# Altium schematic sheet MCU.SchDoc
size A3; SheetNumber: 2; SheetTotal: 4
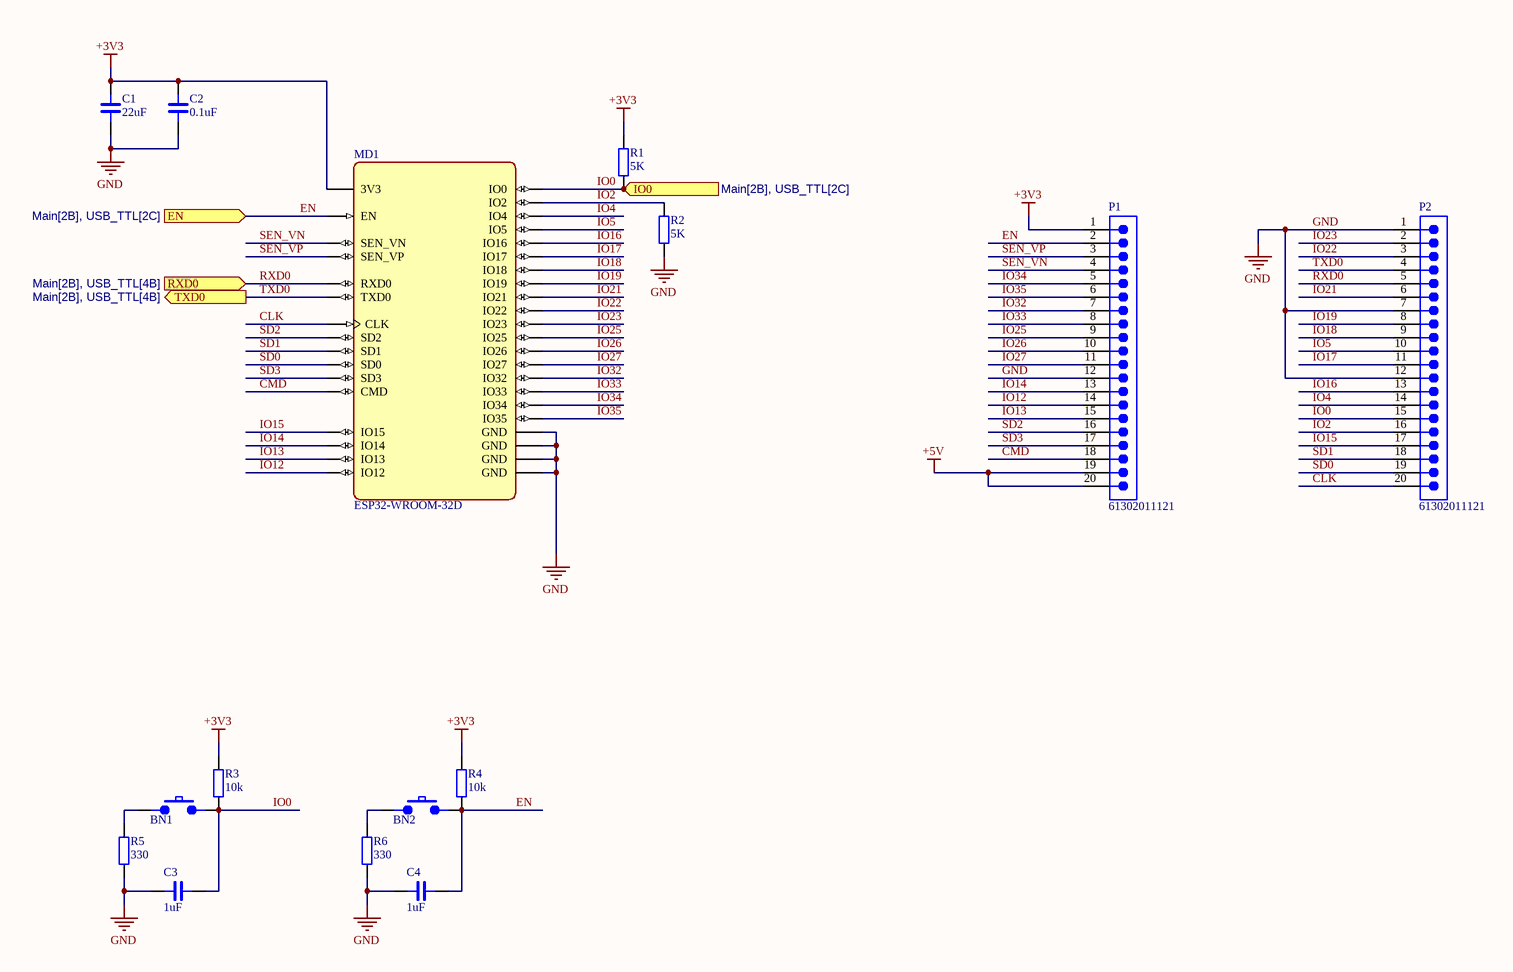
[diagram p0: MCU.SchDoc]

## Parts
BN1  SKRPABE010  [BTN_SKRPABE010]  (value not drawn)
BN2  SKRPABE010  [BTN_SKRPABE010]  (value not drawn)
C1  22uF  [CAP_0603]
C2  0.1uF  [CAP_0603]
C3  1uF  [CAP_0603]
C4  1uF  [CAP_0603]
MD1  ESP32-WROOM-32D  [MD_ESP32_WROOM_D]
P1  61302011121  [61302011121]
P2  61302011121  [61302011121]
R1  5K  [RES_0603]
R2  5K  [RES_0603]
R3  10k  [RES_0603]
R4  10k  [RES_0603]
R5  330  [RES_0603]
R6  330  [RES_0603]

## Ports
EN (in, see Main[2B], USB_TTL[2C]), IO0 (in, see Main[2B], USB_TTL[2C]), RXD0 (in, see Main[2B], USB_TTL[4B]), TXD0 (out, see Main[2B], USB_TTL[4B])

## Nets
+3V3: C1.2 C2.2 MD1.2(3V3) P1.1 R1.2 R3.2 R4.2
+5V: P1.19 P1.20
GND: C1.1 C2.1 C3.1 C4.1 MD1.1(GND) MD1.15(GND) MD1.38(GND) MD1.39(GND) P1.12 P2.1 P2.7 P2.12 R2.1 R5.1 R6.1
CLK: MD1.20(CLK) P2.20
CMD: MD1.19(CMD) P1.18
EN: BN2.34 C4.2 MD1.3(EN) P1.2 R4.1 ; port EN
IO0: BN1.34 C3.2 MD1.25(IO0) P2.15 R1.1 R3.1 ; port IO0
IO2: MD1.24(IO2) P2.16 R2.2
IO4: MD1.26(IO4) P2.14
IO5: MD1.29(IO5) P2.10
IO12: MD1.14(IO12) P1.14
IO13: MD1.16(IO13) P1.15
IO14: MD1.13(IO14) P1.13
IO15: MD1.23(IO15) P2.17
IO16: MD1.27(IO16) P2.13
IO17: MD1.28(IO17) P2.11
IO18: MD1.30(IO18) P2.9
IO19: MD1.31(IO19) P2.8
IO21: MD1.33(IO21) P2.6
IO22: MD1.36(IO22) P2.3
IO23: MD1.37(IO23) P2.2
IO25: MD1.10(IO25) P1.9
IO26: MD1.11(IO26) P1.10
IO27: MD1.12(IO27) P1.11
IO32: MD1.8(IO32) P1.7
IO33: MD1.9(IO33) P1.8
IO34: MD1.6(IO34) P1.5
IO35: MD1.7(IO35) P1.6
RXD0: MD1.34(RXD0) P2.5 ; port RXD0
SD0: MD1.21(SD0) P2.19
SD1: MD1.22(SD1) P2.18
SD2: MD1.17(SD2) P1.16
SD3: MD1.18(SD3) P1.17
SEN_VN: MD1.5(SEN_VN) P1.4
SEN_VP: MD1.4(SEN_VP) P1.3
TXD0: MD1.35(TXD0) P2.4 ; port TXD0
NetBN1_12: BN1.12 R5.2
NetBN2_12: BN2.12 R6.2

## Library data of the parts
BN1 BN2 = BTN_SKRPABE010: 3.2mm 2.5mm button 50mA Brick SPST 16V SMD Tactile Switches; Mfr.part: SKRPABE010; JLCPCB Part: ?; LCSC Part: ?
C1-C4 = CAP_0603: 0603 Multilayer Ceramic Capacitors MLCC - SMD/SMT ROHS; LCSC Part: ?; JLCPCB Part: ?; Mfr. Part: ?; Voltage: ?
  C1: Value: 22uF
  C2: Value: 0.1uF
  C3 C4: Value: 1uF
MD1 = MD_ESP32_WROOM_D: core ESP32-D0WD, 32Mbits, 3.3V, 40Mhz, onboard antenna; Mrf. Part: ?; LCSCPCB Part: ?; JLCPCB Part: ?
P1 P2 = CMP-1502-01102-3: NexarPartId: 32855554; Operating Supply Voltage: 250V; Gender: Male; Current Rating: 3A; Contact Resistance: 20mΩ; Number of Contacts: 20; Pitch: 2.54mm; Connector Type: Male Pin; RoHS: Compliant; Contact Plating: Gold; REACH SVHC: Unknown; Packaging: Bulk; Lead Pitch: 2.54mm; Mount: Through Hole; Termination: Solder; Number of Pins: 20; Contact Mating Length: 5.9944mm; Number of Rows: 1; Color: Black; Contact Material: Copper; Orientation: Vertical; Number of Positions: 20
R1-R6 = RES_0603: 0603 Thick Film Resistor - Surface Mount ROHS; Mfr. Part: ?; LCSC Part: ?; JLCPCB Part: ?
  R1 R2: Value: 5K
  R3 R4: Value: 10k
  R5 R6: Value: 330